# EAGLE schematic audio sw (EAGLE 6.5.0)
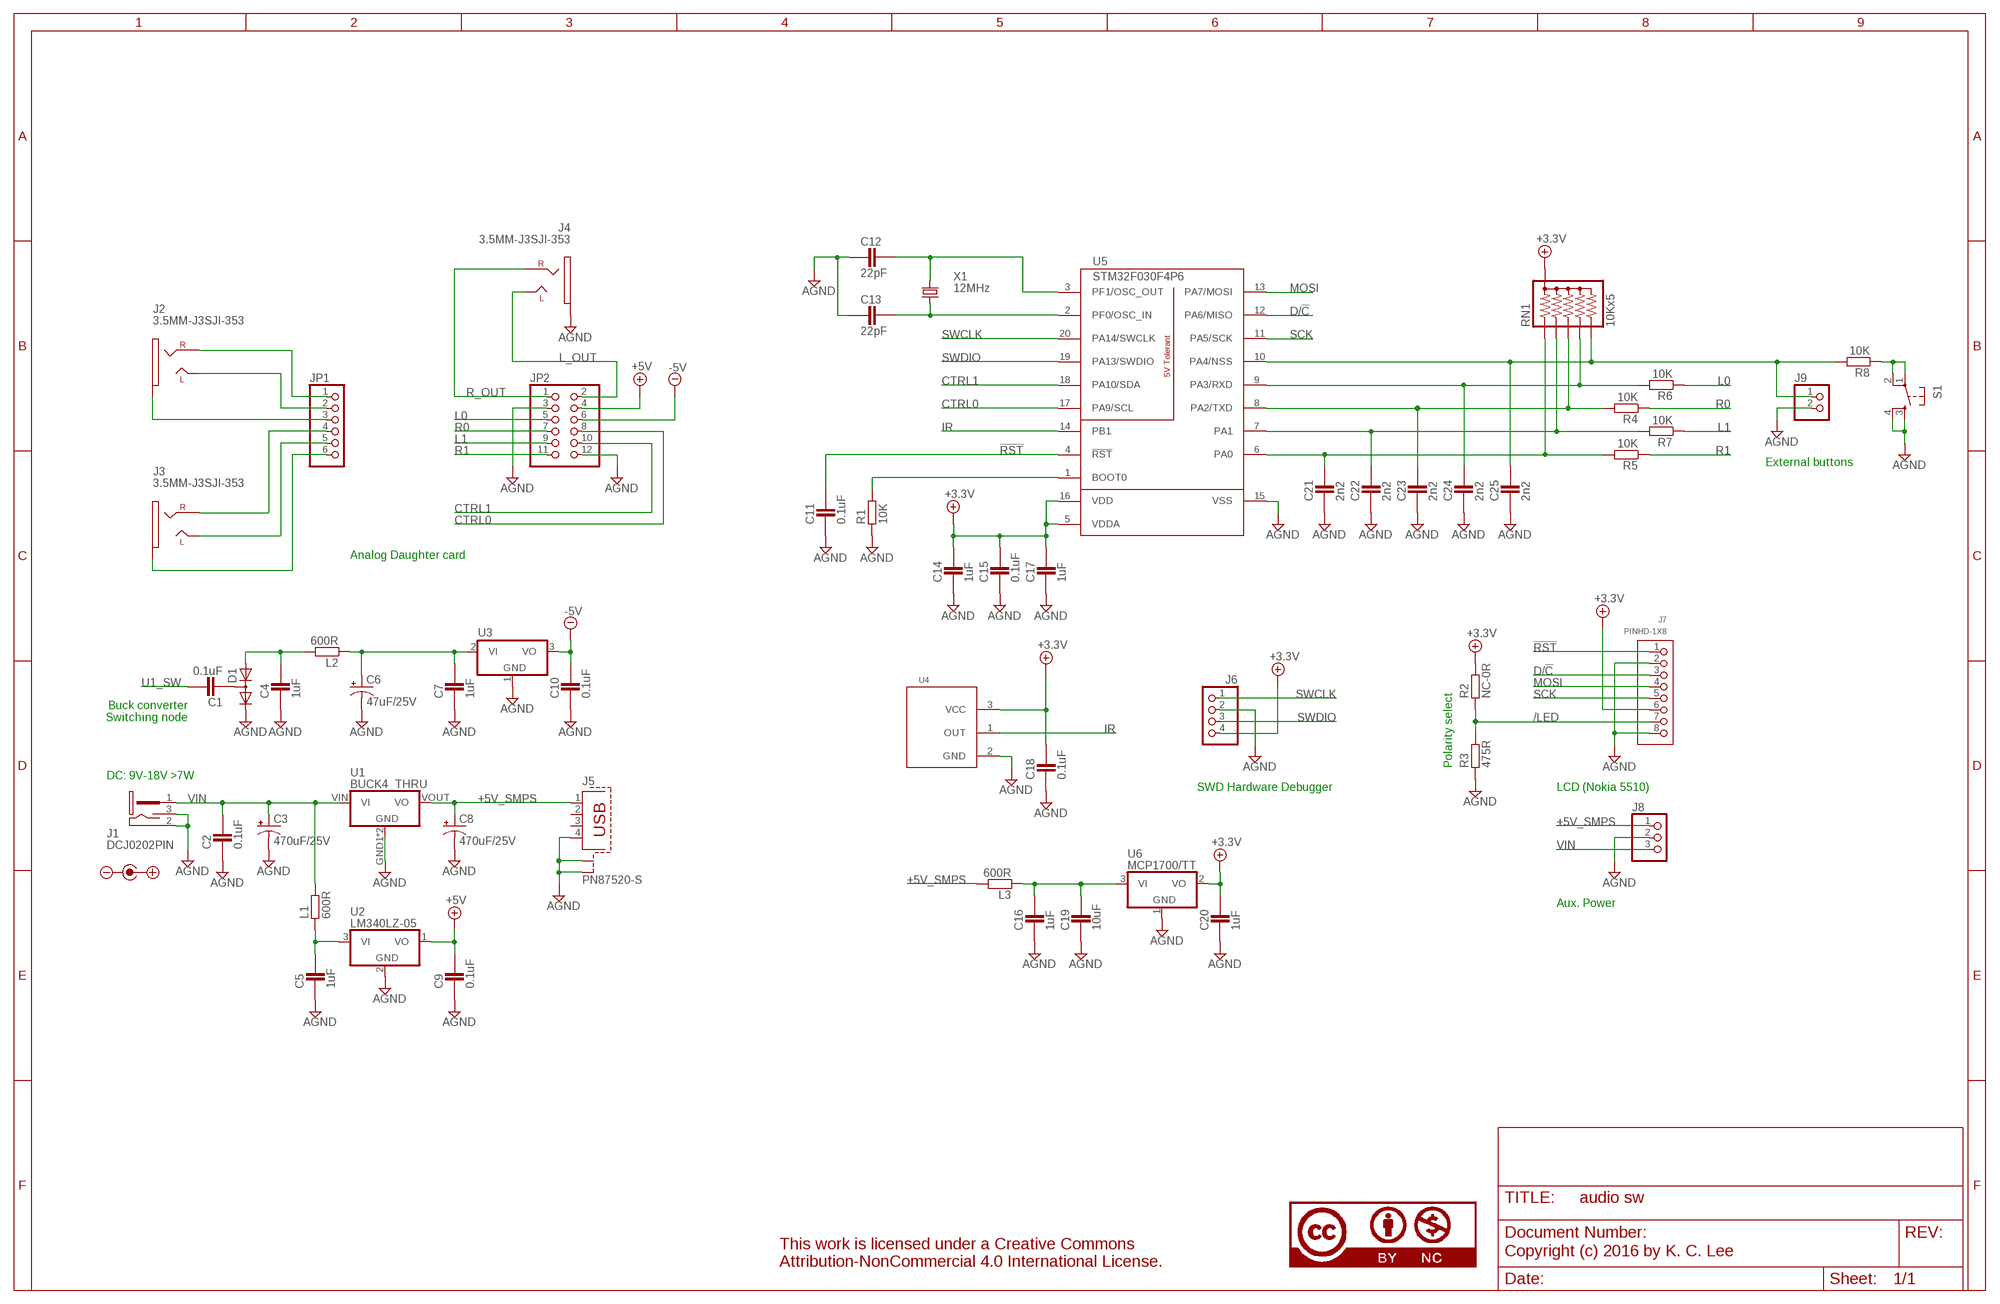
[diagram p0: schematic, sheet 1]

## Parts
$1_40_$  CC-BY-NC100%  [CC-BY-NC-100]
C1  0.1uF  CAPACITOR_0603  [CAPC1608X92N]
C2  0.1uF  CAPACITOR_0805  [CAPC2012X145AN]
C3  470uF/25V  CAP_POLPTH3  [CPOL-RADIAL-470UF-25V]
C4  1uF  CAPACITOR_0603  [CAPC1608X92N]
C5  1uF  CAPACITOR_0603  [CAPC1608X92N]
C6  47uF/25V  CAP_POLPTH2  [CPOL-RADIAL-10UF-25V]
C7  1uF  CAPACITOR_0603  [CAPC1608X92N]
C8  470uF/25V  CAP_POLPTH3  [CPOL-RADIAL-470UF-25V]
C9  0.1uF  CAPACITOR_0603  [CAPC1608X92N]
C10  0.1uF  CAPACITOR_0603  [CAPC1608X92N]
C11  0.1uF  CAPACITOR_0603  [CAPC1608X92N]
C12  22pF  CAPACITOR_0603  [CAPC1608X92N]
C13  22pF  CAPACITOR_0603  [CAPC1608X92N]
C14  1uF  CAPACITOR_0603  [CAPC1608X92N]
C15  0.1uF  CAPACITOR_0603  [CAPC1608X92N]
C16  1uF  CAPACITOR_0603  [CAPC1608X92N]
C17  1uF  CAPACITOR_0603  [CAPC1608X92N]
C18  0.1uF  CAPACITOR_0603  [CAPC1608X92N]
C19  10uF  CAPACITOR_0805  [CAPC2012X145AN]
C20  1uF  CAPACITOR_0603  [CAPC1608X92N]
C21  2n2  CAPACITOR_0603  [CAPC1608X92N]
C22  2n2  CAPACITOR_0603  [CAPC1608X92N]
C23  2n2  CAPACITOR_0603  [CAPC1608X92N]
C24  2n2  CAPACITOR_0603  [CAPC1608X92N]
C25  2n2  CAPACITOR_0603  [CAPC1608X92N]
D1  KA2KA_SOT-23  [SOT95P280X135-3N]
J1  DCJ0202PIN  [PJ-102A]
J2  3.5MM-J3SJI-353  [CUI-3MM]
J3  3.5MM-J3SJI-353  [CUI-3MM]
J4  3.5MM-J3SJI-353  [CUI-3MM]
J5  PN87520-S  [PN87520-S]
J6  PINHD-1X4_2.54  [1X04]
J7  PINHD-1X8  [1X08]
J8  PINHD-1X3  [1X03]
J9  PINHD-1X2_2.54  [1X02]
JP1  PINHD-1X6  [1X06]
JP2  PINHD-2X6_2.54  [2X06]
L1  600R  RESISTOR_0805  [RESC2012X70N]
L2  600R  RESISTOR_0805  [RESC2012X70N]
L3  600R  RESISTOR_0805  [RESC2012X70N]
R1  10K  RESISTOR_0603  [RESC1608X55N]
R2  NC-0R  RESISTOR_0603  [RESC1608X55N]
R3  475R  RESISTOR_0603  [RESC1608X55N]
R4  10K  RESISTOR_0603  [RESC1608X55N]
R5  10K  RESISTOR_0603  [RESC1608X55N]
R6  10K  RESISTOR_0603  [RESC1608X55N]
R7  10K  RESISTOR_0603  [RESC1608X55N]
R8  10K  RESISTOR_0603  [RESC1608X55N]
RN1  10Kx5  RPACK-BUSSED-SIP-PTH-5  [RPACK-SIP-PTH-5]
S1  TAC_SWITCHPTH  [TACTILE-PTH]
U1  BUCK4_THRU  [PWR4_THRU]
U2  LM340LZ-05  [TO92-CLP]
U3  79L05Z  [TO92-CLP]
U4  AX-1838HS  [AX1838]
U5  STM32F030F4P6  [TSSOP20]
U6  MCP1700/TT  [SOT95P280X135-3N]
U$1  POLARITY  [POLARITY]
X1  12MHz  CRYSTALHC49U-V  [HC49U-V]

## Nets
!RST: C11.2 J7.1 U5.4(!RST)
+3.3V: C14.2 C15.2 C17.2 C18.2 C20.2 J6.4 J7.6 R2.2 RN1.P$1 U4.3(VCC) U5.5(VDDA) U5.16(VDD) U6.2(VO)
+5V: C9.2 JP2.4 U2.1(VO)
+5V_SMPS: C8.+ J5.1 J8.1 L3.2 U1.VOUT(VO)
-5V: C10.2 JP2.6 U3.3(VO)
/LED: J7.7 R2.1 R3.2
AGND: C2.1 C3.- C4.1 C5.1 C6.2(-) C7.1 C8.- C9.1 C10.1 C11.1 C12.1 C13.1 C14.1 C15.1 C16.1 C17.1 C18.1 C19.1 C20.1 C21.1 C22.1 C23.1 C24.1 C25.1 D1.2(K) J1.2 J1.3 J4.1 J5.4 J5.S1 J5.S2 J6.2 J7.2 J7.8 J8.2 J9.2 JP2.3 JP2.12 R1.1 R3.1 S1.3 S1.4 U1.GND1(GND) U1.GND2(GND) U2.2(GND) U3.1(GND) U4.2(GND) U5.15(VSS) U6.1(GND)
CTRL0: JP2.8 U5.17(PA9/SCL)
CTRL1: JP2.10 U5.18(PA10/SDA)
D/!C: J7.3 U5.12(PA6/MISO)
IR: U4.1(OUT) U5.14(PB1)
L0: JP2.5 R6.1
L1: JP2.9 R7.1
L_OUT: J4.2 JP2.2
MOSI: J7.4 U5.13(PA7/MOSI)
N$1: C16.2 C19.2 L3.1 U6.3(VI)
N$4: J2.3 JP1.1
N$5: J2.1 JP1.3
N$9: J2.2 JP1.2
N$14: J3.3 JP1.4
N$15: J3.1 JP1.6
N$19: J3.2 JP1.5
N$22: C5.2 L1.1 U2.3(VI)
N$23: R8.1 S1.1 S1.2
N$25: C6.1(+) C7.2 L2.1 U3.2(VI)
N$27: C1.1 D1.3(KA)
N$29: C4.2 D1.1(A) L2.2
N$32: R1.2 U5.1(BOOT0)
N$36: C21.2 R5.2 RN1.P$2 U5.6(PA0)
N$37: C22.2 R7.2 RN1.P$3 U5.7(PA1)
N$38: C23.2 R4.2 RN1.P$4 U5.8(PA2/TXD)
N$39: C24.2 R6.2 RN1.P$5 U5.9(PA3/RXD)
N$40: C25.2 J9.1 R8.2 RN1.P$6 U5.10(PA4/NSS)
N$41: C13.2 U5.2(PF0/OSC_IN) X1.1
N$42: C12.2 U5.3(PF1/OSC_OUT) X1.2
R0: JP2.7 R4.1
R1: JP2.11 R5.1
R_OUT: J4.3 JP2.1
SCK: J7.5 U5.11(PA5/SCK)
SWCLK: J6.1 U5.20(PA14/SWCLK)
SWDIO: J6.3 U5.19(PA13/SWDIO)
U1_SW: C1.2
VIN: C2.2 C3.+ J1.1 J8.3 L1.2 U1.VIN(VI)
Unconnected: J5.2 J5.3

## Notes on the sheet
- External buttons
- Analog Daughter card
- Buck converter
  Switching node
- Polarity select
- DC: 9V-18V >7W
- SWD Hardware Debugger | LCD (Nokia 5510)
- Aux. Power
- Copyright (c) 2016 by K. C. Lee

## Library data of the parts
$1_40_$ = Misc logo:CC-BY-NC
C1 C2 C4 C5 C7 C9-C25 = ipc-7351-capacitor:CAPACITOR_
C3 C6 C8 = Misc Passives:CAP_POL: Capacitor Polarized These are standard SMD and PTH capacitors. Normally 10uF, 47uF, and 100uF in electrolytic and tantalum varieties. Always verify the external diameter of the through hole cap, it varies with capacity, voltage, and manufacturer. The EIA devices should be standard.
D1 = ipc-7351-diode:KA2KA_
J1 = Misc Conn:DCJ0202: DC POWER JACK Source: DCJ0202.pdf Pin = CUI Inc. PJ-102A with formed pins
J2-J4 = Misc Conn:3.5MM-J3
J5 = con-berg:PN87520-S; OC_FARNELL: unknown; OC_NEWARK: unknown
J6 = Misc Conn:PINHD-1X4: PIN HEADER
J7 = Misc Conn:PINHD-1X8
J8 = Misc Conn:PINHD-1X3: PIN HEADER
J9 = Misc Conn:PINHD-1X2: PIN HEADER
JP1 = Misc Conn:PINHD-1X6: PIN HEADER
JP2 = pinhead-1:PINHD-2X6: PIN HEADER
L1-L3 R1-R8 = ipc-7351-resistor:RESISTOR_
RN1 = SparkFun-Passives:RPACK*: BOURNS 4600X series thick-film SIP resistor packs Five resistors bussed to a single pin (denoted by dot). 0.2W / resistor datasheet <http://dlnmh9ip6v2uc.cloudfront.net/datasheets/Components/General/4600x.pdf> SFE parts COM-10855 (330), COM-10856 (10K)
S1 = SparkFun-Electromechanical:TAC_SWITCH: Momentary Switch Button commonly used for reset or general input. Spark Fun Electronics SKU : COM-00097 SMT- SWCH-08247
U1 = Misc Power:BUCK4_
U2 = linear:LM340?-*: Positive VOLTAGE REGULATOR Source: http://cache.national.com/ds/LM/LM340.pdf
U3 = linear:79*: Negative VOLTAGE REGULATOR
U4 = Misc opto:AX-1838
U5 = Misc Processor:STM32F030F4P6
U6 = Misc Power:MCP1700
U$1 = Misc logo:POLARITY
X1 = crystal:CRYSTAL: CRYSTAL; OC_FARNELL: 1666969; OC_NEWARK: unknown